# Altium schematic sheet USB_to_UART.SchDoc
size A; SheetNumber: 11; SheetTotal: 11
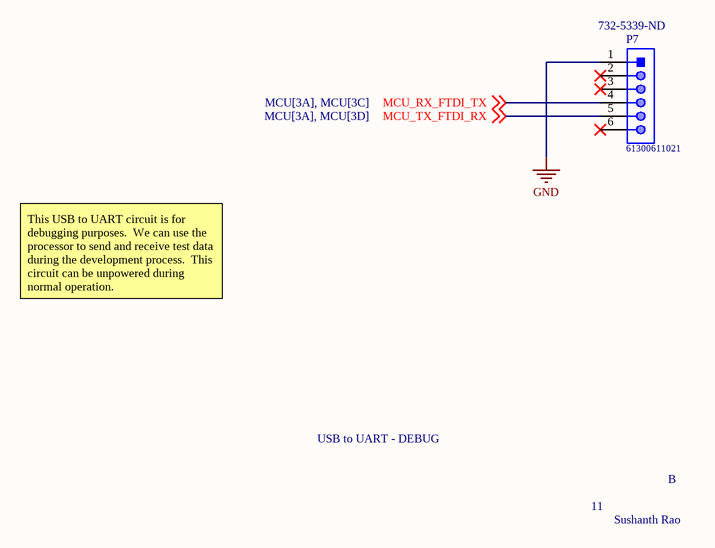
[diagram p0: USB_to_UART.SchDoc]

## Parts
P7  61300611021  Supplier Part Number 1: 732-5339-ND  [61300611021]

## Nets
GND: P7.1
MCU_RX_FTDI_TX: P7.4 ; off-sheet MCU_RX_FTDI_TX
MCU_TX_FTDI_RX: P7.5 ; off-sheet MCU_TX_FTDI_RX

Not connected (* = marked no-connect by the designer): P7 2* 3* 6*

## Notes on the sheet
- This USB to UART circuit is for debugging purposes.  We can use the processor to send and receive test data during the development process.  This circuit can be unpowered during normal operation.
- USB to UART - DEBUG
- 11
- B
- Sushanth Rao

## Library data of the parts
P7 = CMP-1502-01069-1: THT Angled Pin Header WR-PHD, Pitch 2.54 mm, Single Row, 6 pins; Manufacturer: Wurth Elektronik; Pin Number: 6; Gender: Male; Withstanding Voltage: 500VAC; Rated Current: 3A; Working Voltage: 250VAC; Contact Resistance: 20mOhm; Pitch: 2.54mm; Voltage Rating: 250V; Operating Temperature: -40to105degC; Package Reference: 61300611021; Packaging: Bag; Orientation: Angled; Manufacturer URL: http://www.we-online.de; Datasheet URL: https://katalog.we-online.de/em/datasheet/6130xx11021.pdf; Mounting Technology: THT; Publisher: WurthElektronik; Row Number: Single; Part Number: 61300611021; Supplier 1: Digi-Key; Manufacturer Part Number: 61300611021; RoHS: Yes; Category: Connectors; Stock 1: 9975; Pricing 1: 1=0.57000, 10=0.48400, 25=0.40400, 50=0.33700, 100=0.30600, 1000=0.27800 (USD); Contact Plating: Gold; Contact Material: Copper Alloy,Copper; Color: Black; Contact Shape: Square; Contact Finish - Mating: GOLD; Insulation Material: Nylon; Insulation Color: Black; Min Operating Temperature: -40°C; Max Operating Temperature: 125°C; Number of Rows: 1; Number of Positions: 6; Termination: Solder; Number of Contacts: 6; Connector Type: Header; Fastening Type: Pull; Series: WR-PHD; Contact Type: Male Pin; Contact Mating Length: 0.236inch; RoHS Compliant: Yes; Flammability Rating: UL94 V-0; ComponentLink1URL: https://datasheet.ciiva.com/28505/1442172-28505419.pdf?src-supplier=Element14; ComponentLink1Description: https://datasheet.ciiva.com/28505/1442172-28505419.pdf?src-supplier=Element14